# Altium schematic sheet Sheet1.SchDoc
size A; SheetNumber: 1; SheetTotal: 1
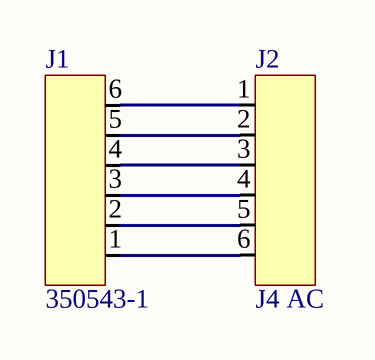
[diagram p0: Sheet1.SchDoc]

## Parts
J1  350543-1  [TE_350543-1]
J2  J4 AC  [J4 AC]

## Nets
NetJ1_1: J1.1 J2.6
NetJ1_2: J1.2 J2.5
NetJ1_3: J1.3 J2.4
NetJ1_4: J1.4 J2.3
NetJ1_5: J1.5 J2.2
NetJ1_6: J1.6 J2.1

## Library data of the parts
J1 = 350543-1: MF: {'manufacturer': u'TE Connectivity'}; Package: None; MP: 350543-1; Price: None; Value: *; Availability: Unavailable